# EAGLE design BMV1 (EAGLE 4.16)
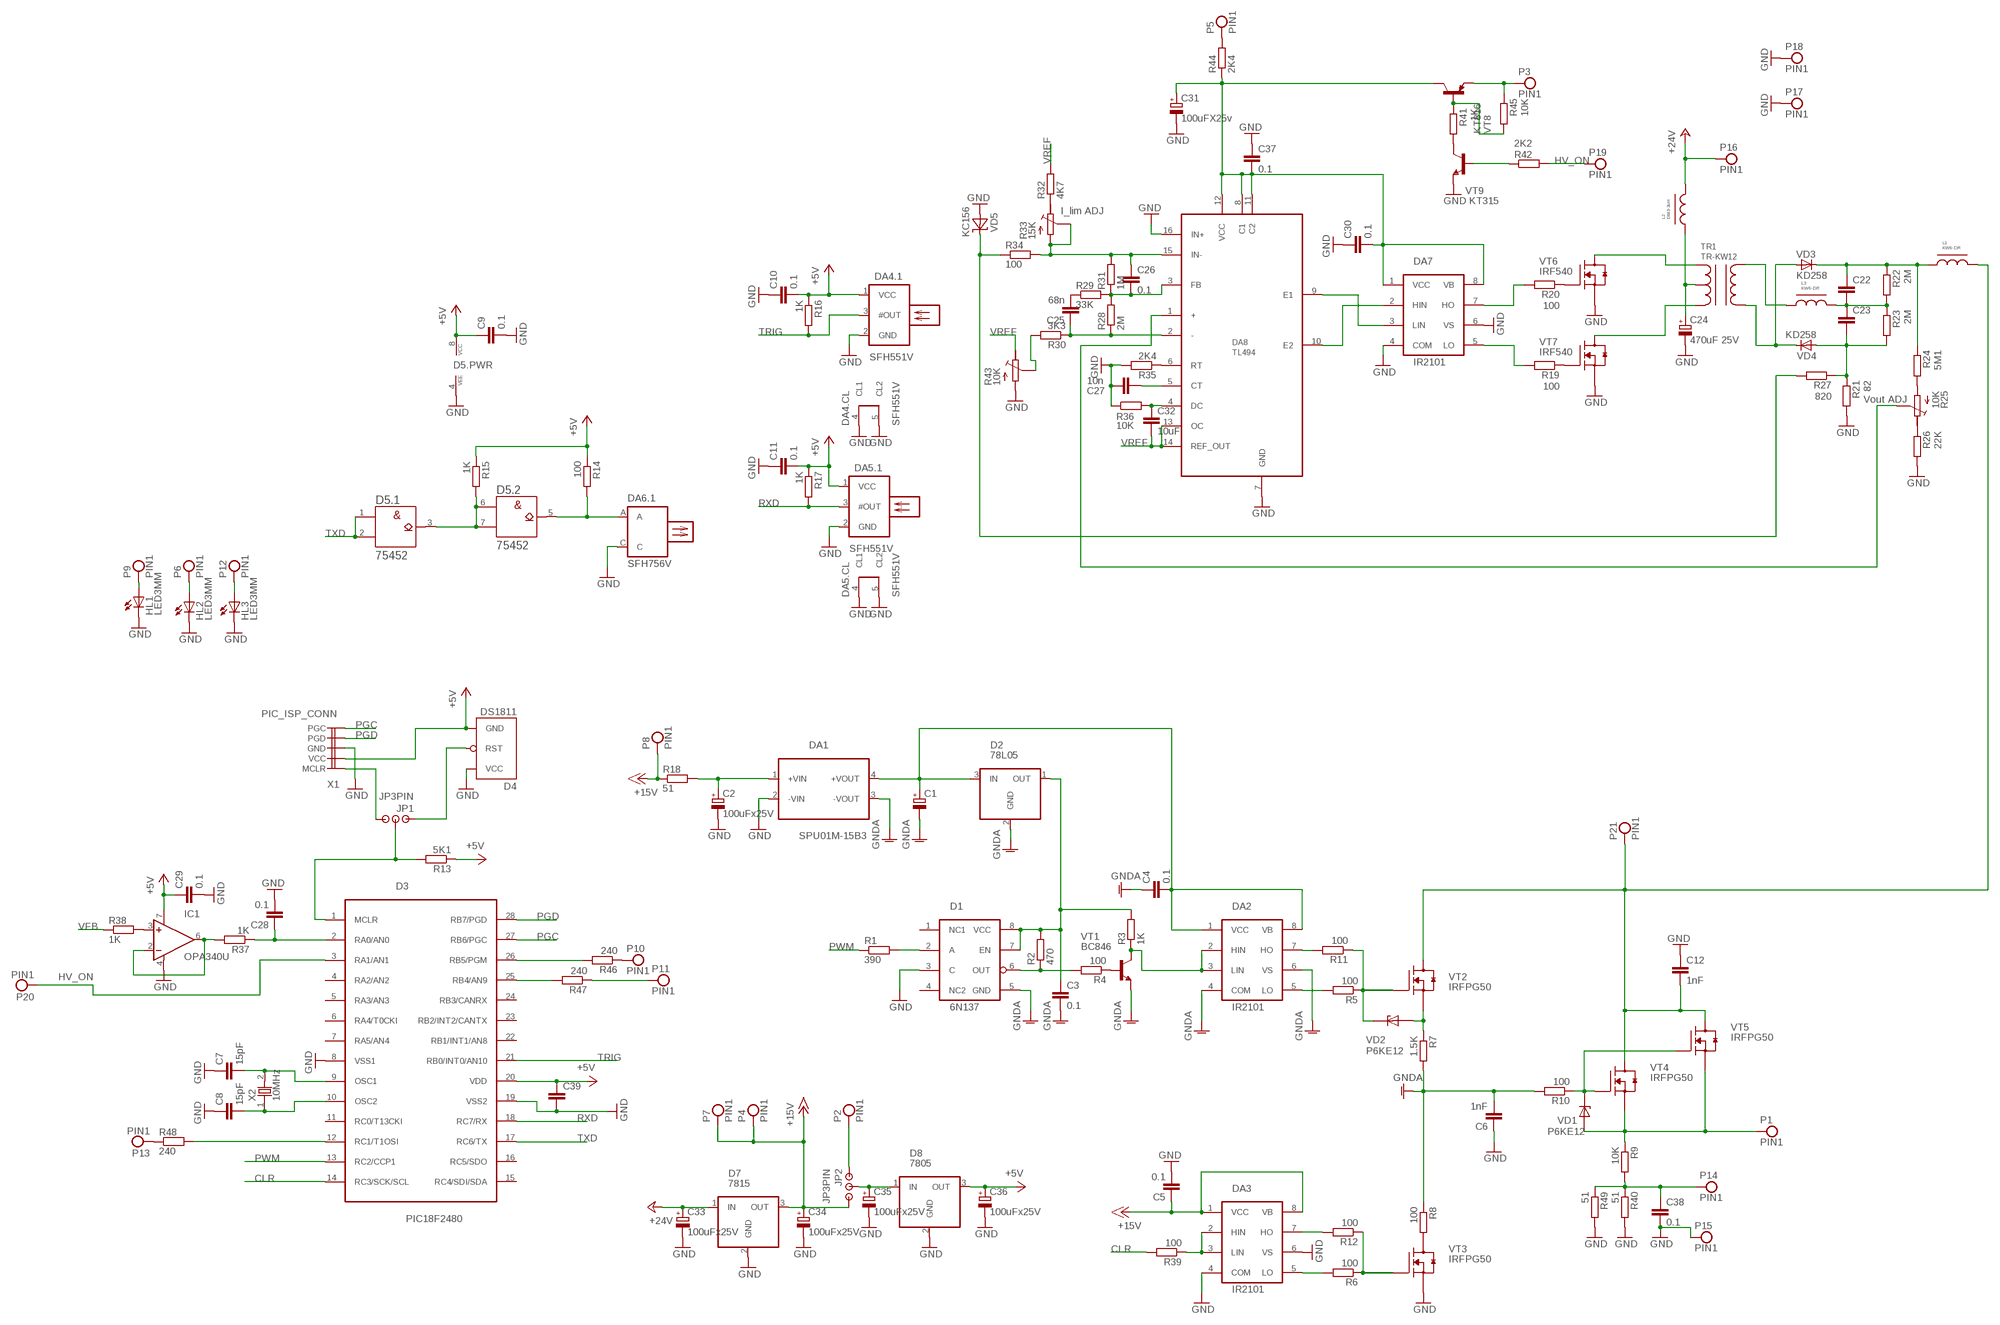
[diagram p0: schematic, sheet 1]

## Parts
C1  C100MFX25V  [C100MILX6X12]
C2  100uFx25V  C100MFX25V  [C100MILX6X12]
C3  0.1  C0805  [C0805D]
C4  0.1  C0805KM-6  [C050-025X075]
C5  0.1  C0805  [C0805D]
C6  1nF  C1NF1600V  [K15-5-1]
C7  15pF  C0805  [C0805D]
C8  15pF  C0805  [C0805D]
C9  0.1  C0805  [C0805D]
C10  0.1  C0805  [C0805D]
C11  0.1  C0805  [C0805D]
C12  1nF  C1NF1600V  [K15-5-1]
C22  0.47UF630V  [K73-17-2]
C23  0.47UF630V  [K73-17-2]
C24  470uF 25V  C470X25V  [ELC8X3,5]
C25  68n  KM-6SMD  [C0805D]
C26  0.1  KM-6SMD  [C0805D]
C27  10n  KM-6SMD  [C0805D]
C28  0.1  C0805  [C0805D]
C29  0.1  C0805  [C0805D]
C30  0.1  KM-6SMD  [C0805D]
C31  100uFX25v  C100MFX25V  [C100MILX6X12]
C32  10uF  KM-6SMD  [C0805D]
C33  100uFx25V  C100MFX25V  [C100MILX6X12]
C34  100uFx25V  C100MFX25V  [C100MILX6X12]
C35  100uFx25V  C100MFX25V  [C100MILX6X12]
C36  100uFx25V  C100MFX25V  [C100MILX6X12]
C37  0.1  KM-6SMD  [C0805D]
C38  0.1  C0805  [C0805D]
C39  KM-6SMD1  [C0603]
D1  6N137  [DIL08]
D2  78L05  [TO92-60]
D3  PIC18F2480  [SO-28W]
D4  DS1811  [TO92-60]
D5  75452  [DIL08]
D7  7815  [TO220V]
D8  7805  [TO220V]
DA1  SPU01M-15B3  [SIL7-V2]
DA2  IR2101  [DIL08]
DA3  IR2101  [DIL08]
DA4  SFH551V  [SFH551V]
DA5  SFH551V  [SFH551V]
DA6  SFH756V  [SFH756V]
DA7  IR2101  [DIL08]
DA8  TL494  [DIL16]
HL1  LED3MM  [LED3MM]
HL2  LED3MM  [LED3MM]
HL3  LED3MM  [LED3MM]
IC1  OPA340U  [SO08]
JP1  JP3PIN  [PLC-3PIN]
JP2  JP3PIN  [PLC-3PIN]
L1  KW6-DR  [KW6-DR]
L2  DM3-3uH  DM3  [DM3]
L3  KW6-DR  [KW6-DR]
P1  PIN1  [PIN1]
P2  PIN1  [PIN1]
P3  PIN1  [PIN1]
P4  PIN1  [PIN1]
P5  PIN1  [PIN1]
P6  PIN1  [PIN1]
P7  PIN1  [PIN1]
P8  PIN1  [PIN1]
P9  PIN1  [PIN1]
P10  PIN1  [PIN1]
P11  PIN1  [PIN1]
P12  PIN1  [PIN1]
P13  PIN1  [PIN1]
P14  PIN1  [PIN1]
P15  PIN1  [PIN1]
P16  PIN1  [PIN1]
P17  PIN1  [PIN1]
P18  PIN1  [PIN1]
P19  PIN1  [PIN1]
P20  PIN1  [PIN1]
P21  PIN1  [PIN1]
R1  390  MLT025"  [0207/10]
R2  470  MLT025SMD  [R0805D]
R3  1K  MLT025"  [0207/10]
R4  100  MLT025"  [0207/10]
R5  100  MLT025SMD  [R0805D]
R6  100  MLT025SMD  [R0805D]
R7  1.5K  MLT025"  [0207/10]
R8  100  MLT025  [MLT1]
R9  10K  MLT025TWO-2  [TWO-2]
R10  100  MLT025"  [0207/10]
R11  100  MLT025SMD  [R0805D]
R12  100  MLT025SMD  [R0805D]
R13  5K1  MLT025SMD  [R0805D]
R14  100  MLT025SMD  [R0805D]
R15  1K  MLT025SMD  [R0805D]
R16  1K  MLT025SMD  [R0805D]
R17  1K  MLT025SMD  [R0805D]
R18  51  MLT025SMD  [R0805D]
R19  100  MLT025SMD  [R0805D]
R20  100  MLT025"  [0207/10]
R21  82  MLT025"  [0207/10]
R22  2M  MLT025"  [0207/10]
R23  2M  MLT025"  [0207/10]
R24  5M1  MLT025MLT2  [MLT2]
R25  10K  RTRIM3296W  [RTRIM3296W]
R26  22K  MLT025SMD  [R0805D]
R27  820  MLT025"  [0207/10]
R28  2M  MLT025SMD  [R0805D]
R29  33K  MLT025SMD  [R0805D]
R30  3K3  MLT025SMD  [R0805D]
R31  1M  MLT025SMD  [R0805D]
R32  4K7  MLT025SMD  [R0805D]
R33  15K  RTRIM3329H  [RTRIM3329H]
R34  100  MLT025"  [0207/10]
R35  2K4  MLT025SMD  [R0805D]
R36  10K  MLT025SMD  [R0805D]
R37  1K  MLT025"  [0207/10]
R38  1K  MLT025"  [0207/10]
R39  100  MLT025"  [0207/10]
R40  51  MLT025"  [0207/10]
R41  1K  MLT025SMD  [R0805D]
R42  2K2  MLT025"  [0207/10]
R43  10K  RTRIM3296W  [RTRIM3296W]
R44  2K4  MLT025"  [0207/10]
R45  10K  MLT025SMD  [R0805D]
R46  240  MLT025SMD  [R0805D]
R47  240  MLT025SMD  [R0805D]
R48  240  MLT025"  [0207/10]
R49  51  MLT025SMD  [R0805D]
TR1  TR-KW12  [KW12]
VD1  P6KE12  [DO-15]
VD2  P6KE12  [DO-15]
VD3  KD258  [KD-29A]
VD4  KD258  [KD-29A]
VD5  KC156  [KC156]
VT1  BC846  [SOT-23]
VT2  IRFPG50  [TO-247AC]
VT3  IRFPG50  [TO-247AC]
VT4  IRFPG50  [TO-247AC]
VT5  IRFPG50  [TO-247AC]
VT6  IRF540  [TO220V]
VT7  IRF540  [TO220V]
VT8  KT816  [TO126V]
VT9  KT315  [KT315]
X1  PIC_ISP_CONN  [PLC-5PIN]
X2  10MHz  HC49/U  [HC49U-V]

## Nets
+5V: C9.1 C10.2 C11.2 C29.1 C36.PLUS(+) C39.1 D3.20(VDD) D4.3(GND) D5.8(.PWR:VCC) D8.3(OUT) DA4.1(.1:VCC) DA5.1(.1:VCC) IC1.7(V+) R13.P$1 R14.P$1 R15.P$1 R16.P$1 R17.P$1 X1.P$2(VCC)
+15V: C5.1 C34.PLUS(+) D7.3(OUT) DA3.1(VCC) DA3.8(VB) JP2.P$3 P4.P$1 P7.P$1 P8.P$1 R18.P$1
+24V: C33.PLUS(+) D7.1(IN) L2.L2 P16.P$1
CLR: D3.14(RC3/SCK/SCL) R39.2
GND: C2.MINUS(-) C5.2 C6.P$1 C7.1 C8.1 C9.2 C10.1 C11.1 C12.P$1 C24.- C27.2 C28.2 C29.2 C30.1 C31.MINUS(-) C33.MINUS(-) C34.MINUS(-) C35.MINUS(-) C36.MINUS(-) C37.1 C38.2 C39.2 D1.3(C) D3.8(VSS1) D3.19(VSS2) D4.2(VCC) D5.4(.PWR:VEE) D7.2(GND) D8.2(GND) DA1.2(-VIN) DA3.4(COM) DA3.6(VS) DA4.2(.1:GND) DA4.4(.CL:CL1) DA4.5(.CL:CL2) DA5.2(.1:GND) DA5.4(.CL:CL1) DA5.5(.CL:CL2) DA6.C(.1:C) DA7.4(COM) DA7.6(VS) DA8.7(GND) DA8.16(IN+) HL1.K(C) HL2.K(C) HL3.K(C) IC1.4(V-) P15.P$1 P17.P$1 P18.P$1 R21.2 R26.P$2 R35.P$2 R36.P$1 R40.2 R43.3(E) R49.P$2 VD5.A VT3.3(S) VT6.3(S) VT7.3(S) VT9.E X1.P$3(GND)
GNDA: C1.MINUS(-) C3.2 C4.1 C6.P$2 D1.5(GND) D2.2(GND) DA1.3(-VOUT) DA2.4(COM) DA2.6(VS) R7.2 R8.P$1 R10.2 VT1.2(E)
HV_ON: D3.3(RA1/AN1) P19.P$1 P20.P$1 R42.2
N$1: C1.PLUS(+) C4.2 D2.3(IN) DA1.4(+VOUT) DA2.1(VCC) DA2.8(VB)
N$2: C3.1 D1.7(EN) D1.8(VCC) D2.1(OUT) R2.P$2 R3.2
N$3: D1.6(OUT) R2.P$1 R4.2
N$4: D1.2(A) R1.2
N$5: DA2.2(HIN) DA2.3(LIN) R3.1 VT1.3(C)
N$6: R4.1 VT1.1(B)
N$7: DA2.5(LO) R5.P$2
N$8: DA3.5(LO) R6.P$2
N$9: R5.P$1 R11.P$1 VD2.C VT2.1(G)
N$10: R6.P$1 R12.P$1 VT3.1(G)
N$11: R7.1 VD2.A VT2.3(S)
N$12: R8.P$2 VT3.2(D)
N$13: D5.3(.1:Y) D5.6(.2:A) D5.7(.2:B) R15.P$2
N$14: C24.+ L2.L1 TR1.12
N$15: R10.1 VD1.C VT4.1(G) VT5.1(G)
N$16: C12.P$2 L1.L2 P21.P$1 VT2.2(D) VT4.2(D) VT5.2(D)
N$17: DA3.7(HO) R12.P$2
N$18: DA2.7(HO) R11.P$2
N$19: C7.2 D3.9(OSC1) X2.2
N$20: C8.2 D3.10(OSC2) X2.1
N$21: D4.1(RST) JP1.P$1
N$22: JP1.P$3 X1.P$1(MCLR)
N$23: D3.1(MCLR) JP1.P$2 R13.P$2
N$24: D5.5(.2:Y) DA6.A(.1:A) R14.P$2
N$25: C2.PLUS(+) DA1.1(+VIN) R18.P$2
N$26: P1.P$1 R9.P$1 VD1.A VT4.3(S) VT5.3(S)
N$27: R19.P$1 VT7.1(G)
N$28: R20.1 VT6.1(G)
N$29: DA7.5(LO) R19.P$2
N$30: DA7.7(HO) R20.2
N$31: DA3.2(HIN) DA3.3(LIN) R39.1
N$32: TR1.11 VT6.2(D)
N$33: TR1.13 VT7.2(D)
N$34: DA7.3(LIN) DA8.9(E1)
N$35: DA7.2(HIN) DA8.10(E2)
N$36: R27.2 R34.1 VD5.C
N$37: R32.P$1 R33.P$1(A)
N$38: C22.P$2 C23.P$1 L3.L2 R22.2 R23.1
N$39: C22.P$1 L1.L1 R22.1 R24.P$1 VD3.C
N$40: C25.1 DA8.2(-) R28.P$1 R30.P$1
N$41: R24.P$2 R25.3(E)
N$42: R25.1(A) R26.P$1
N$43: C30.2 C31.PLUS(+) C37.2 DA7.1(VCC) DA7.8(VB) DA8.8(C1) DA8.11(C2) DA8.12(VCC) R44.1 VT8.2(C)
N$44: C23.P$2 R21.1 R23.2 R27.1 VD4.A
N$45: C26.2 DA8.3(FB) R28.P$2 R29.P$2 R31.P$1
N$46: C25.2 R29.P$1
N$47: DA8.6(RT) R35.P$1
N$48: C26.1 DA8.15(IN-) R31.P$2 R33.P$2(S) R33.P$3(E) R34.2
N$49: L3.L1 TR1.21
N$50: C27.1 DA8.5(CT)
N$51: C32.1 DA8.4(DC) R36.P$2
N$52: IC1.2(-IN) IC1.6(OUT) R37.2
N$53: C28.1 D3.2(RA0/AN0) R37.1
N$54: IC1.3(+IN) R38.2
N$55: TR1.22 VD3.A VD4.C
N$56: R30.P$2 R43.2(S)
N$57: C38.1 P14.P$1 R9.P$2 R40.1 R49.P$1
N$58: R41.P$1 R45.P$2 VT8.3(B)
N$59: R41.P$2 VT9.C
N$60: JP2.P$1 P2.P$1
N$61: P3.P$1 R45.P$1 VT8.1(E)
N$62: C35.PLUS(+) D8.1(IN) JP2.P$2
N$63: R42.1 VT9.B
N$64: P5.P$1 R44.2
N$65: HL2.A P6.P$1
N$66: HL1.A P9.P$1
N$67: D3.26(RB5/PGM) R46.P$2
N$68: P10.P$1 R46.P$1
N$69: D3.25(RB4/AN9) R47.P$2
N$70: P11.P$1 R47.P$1
N$71: HL3.A P12.P$1
N$72: D3.12(RC1/T1OSI) R48.2
N$73: P13.P$1 R48.1
PGC: D3.27(RB6/PGC) X1.P$5(PGC)
PGD: D3.28(RB7/PGD) X1.P$4(PGD)
PWM: D3.13(RC2/CCP1) R1.1
RXD: D3.18(RC7/RX) DA5.3(.1:#OUT) R17.P$2
TRIG: D3.21(RB0/INT0/AN10) DA4.3(.1:#OUT) R16.P$2
TXD: D3.17(RC6/TX) D5.1(.1:A) D5.2(.1:B)
VFB: DA8.1(+) R25.2(S) R38.1
VREF: C32.2 DA8.13(OC) DA8.14(REF_OUT) R32.P$2 R43.1(A)
Unconnected: D1.1(NC1) D1.4(NC2) D3.4(RA2/AN2) D3.5(RA3/AN3) D3.6(RA4/T0CKI) D3.7(RA5/AN4) D3.11(RC0/T13CKI) D3.15(RC4/SDI/SDA) D3.16(RC5/SDO) D3.22(RB1/INT1/AN8) D3.23(RB2/INT2/CANTX) D3.24(RB3/CANRX) DA6.4(.CL:CL1) DA6.5(.CL:CL2)

## Notes on the sheet
- I_lim ADJ
- Vout ADJ

## Library data of the parts
C1 C2 C31 C33-C36 = den:C100MFX25V
C3-C5 C7-C11 C28 C29 C38 = den:C0805
C6 C12 = den:C1NF1600V
C22 C23 = den:0.47UF630V
C24 = den:C470X25V
C25-C27 C30 C32 C37 C39 = den:KM-6
D1 = den:6N137
D2 = den:78L05
D3 = den:PIC18F2480
D4 = den:DS1811
D5 = den:75452
D7 = den:7815
D8 = den:7805
DA1 = den:SPU01M-15B3
DA2 DA3 DA7 = den:IR2101
DA4 DA5 = den:SFH551V
DA6 = den:SFH756V
DA8 = den:TL494
HL1-HL3 = den:LED3MM
IC1 = burr-brown:OPA340: Rail-to-Rail Operational Amplifiers Single-Supply, MicroAmplifier(TM) Series
JP1 JP2 = den:JP3PIN
L1 L3 = den:KW6-DR
L2 = den:DM3
P1-P21 = den:PIN1
R1-R24 R26-R32 R34-R42 R44-R49 = den:MLT025
R25 R43 = den:RTRIM3296W
R33 = den:RTRIM3329H
TR1 = den:TR-KW12
VD1 VD2 = den:P6KE12
VD3 VD4 = den:KD258
VD5 = den:KC156
VT1 = den:BC846
VT2-VT5 = den:IRFPG50
VT6 VT7 = den:IRF540
VT8 = den:KT816
VT9 = den:KT315
X1 = den:PIC_ISP_CONN
X2 = den:HC49/U

## Board
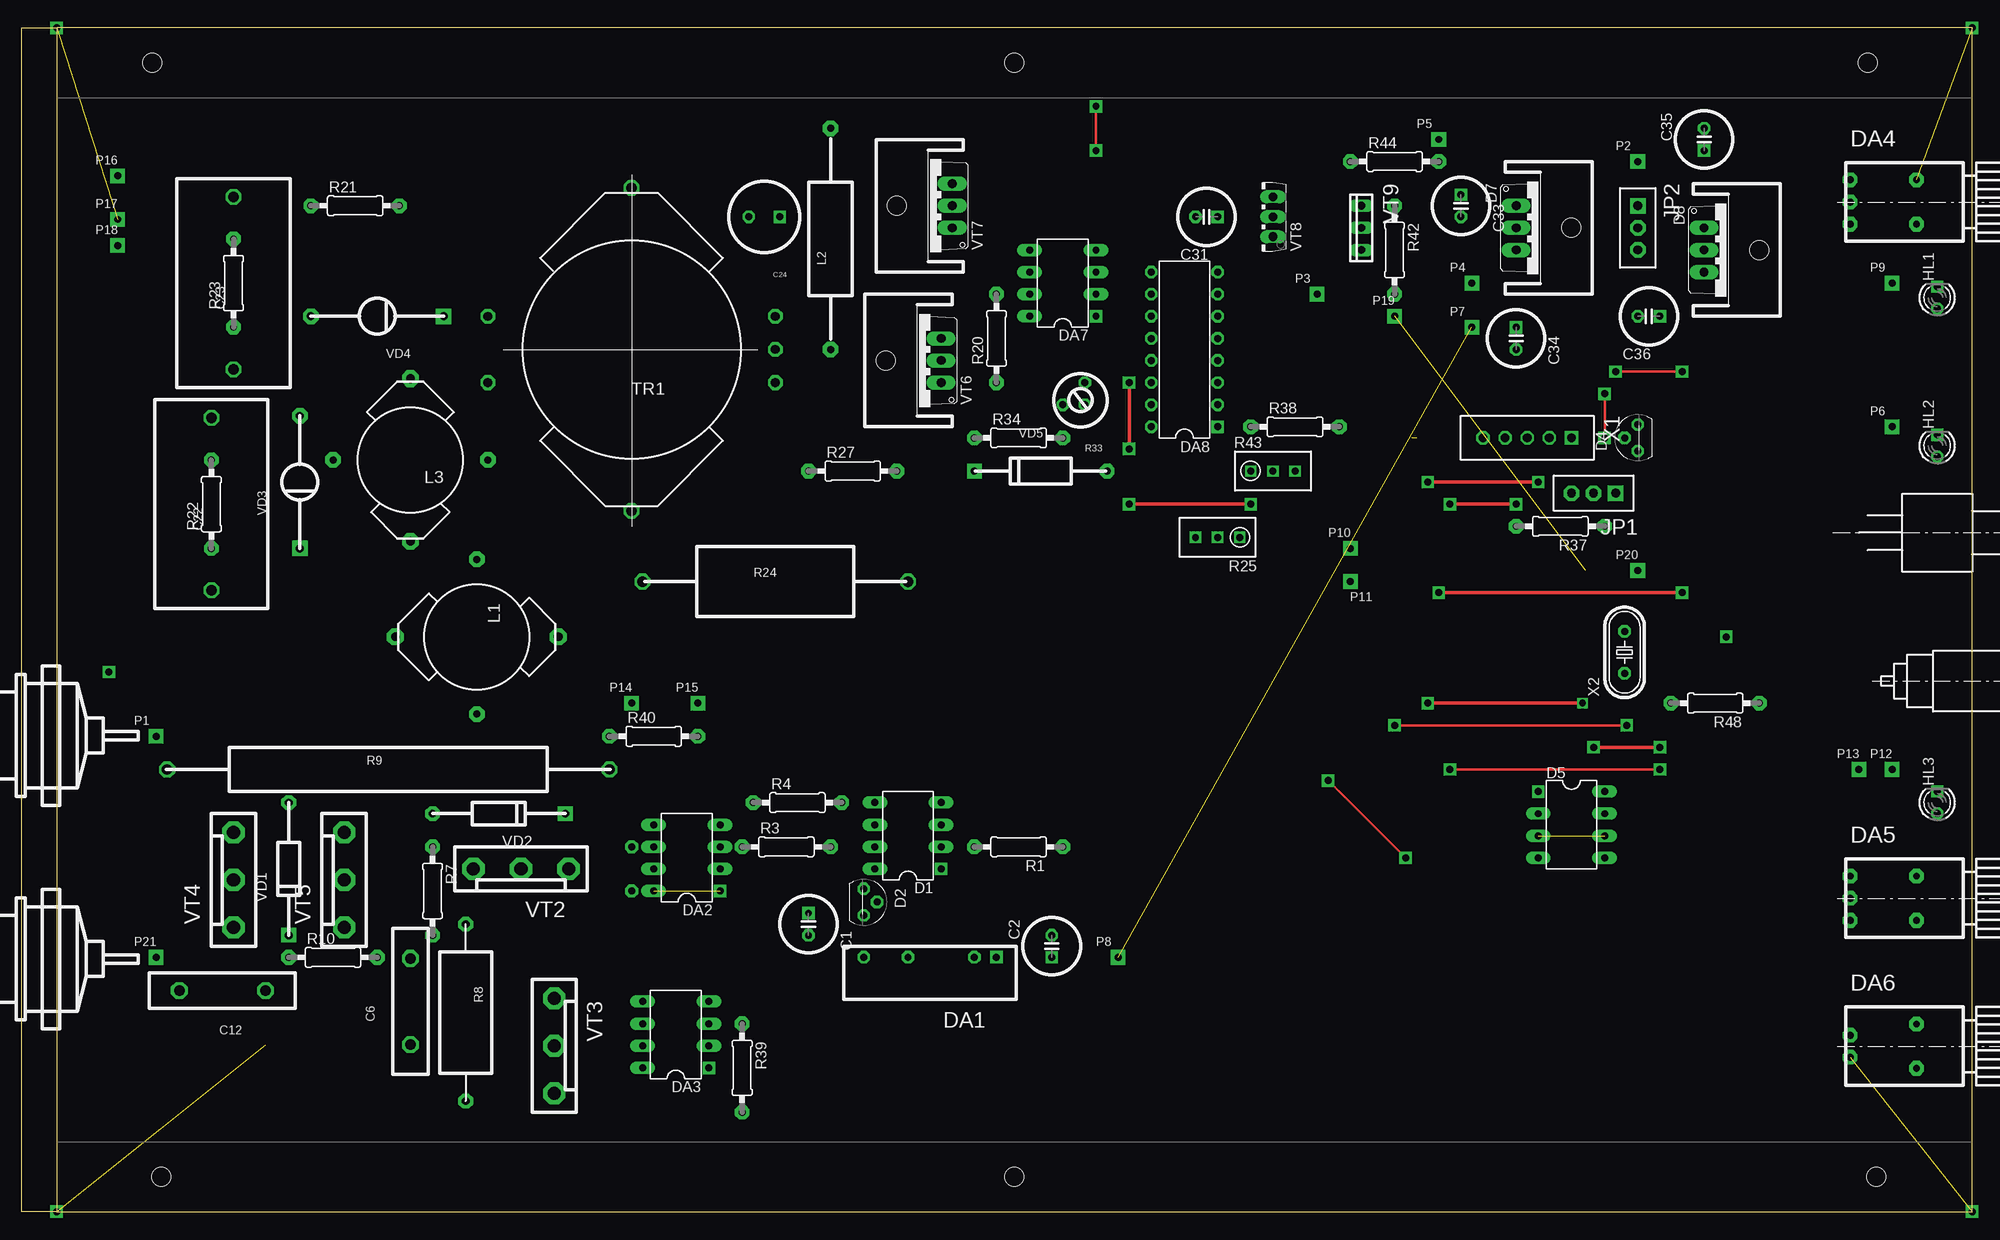
[diagram p1: board, top side]
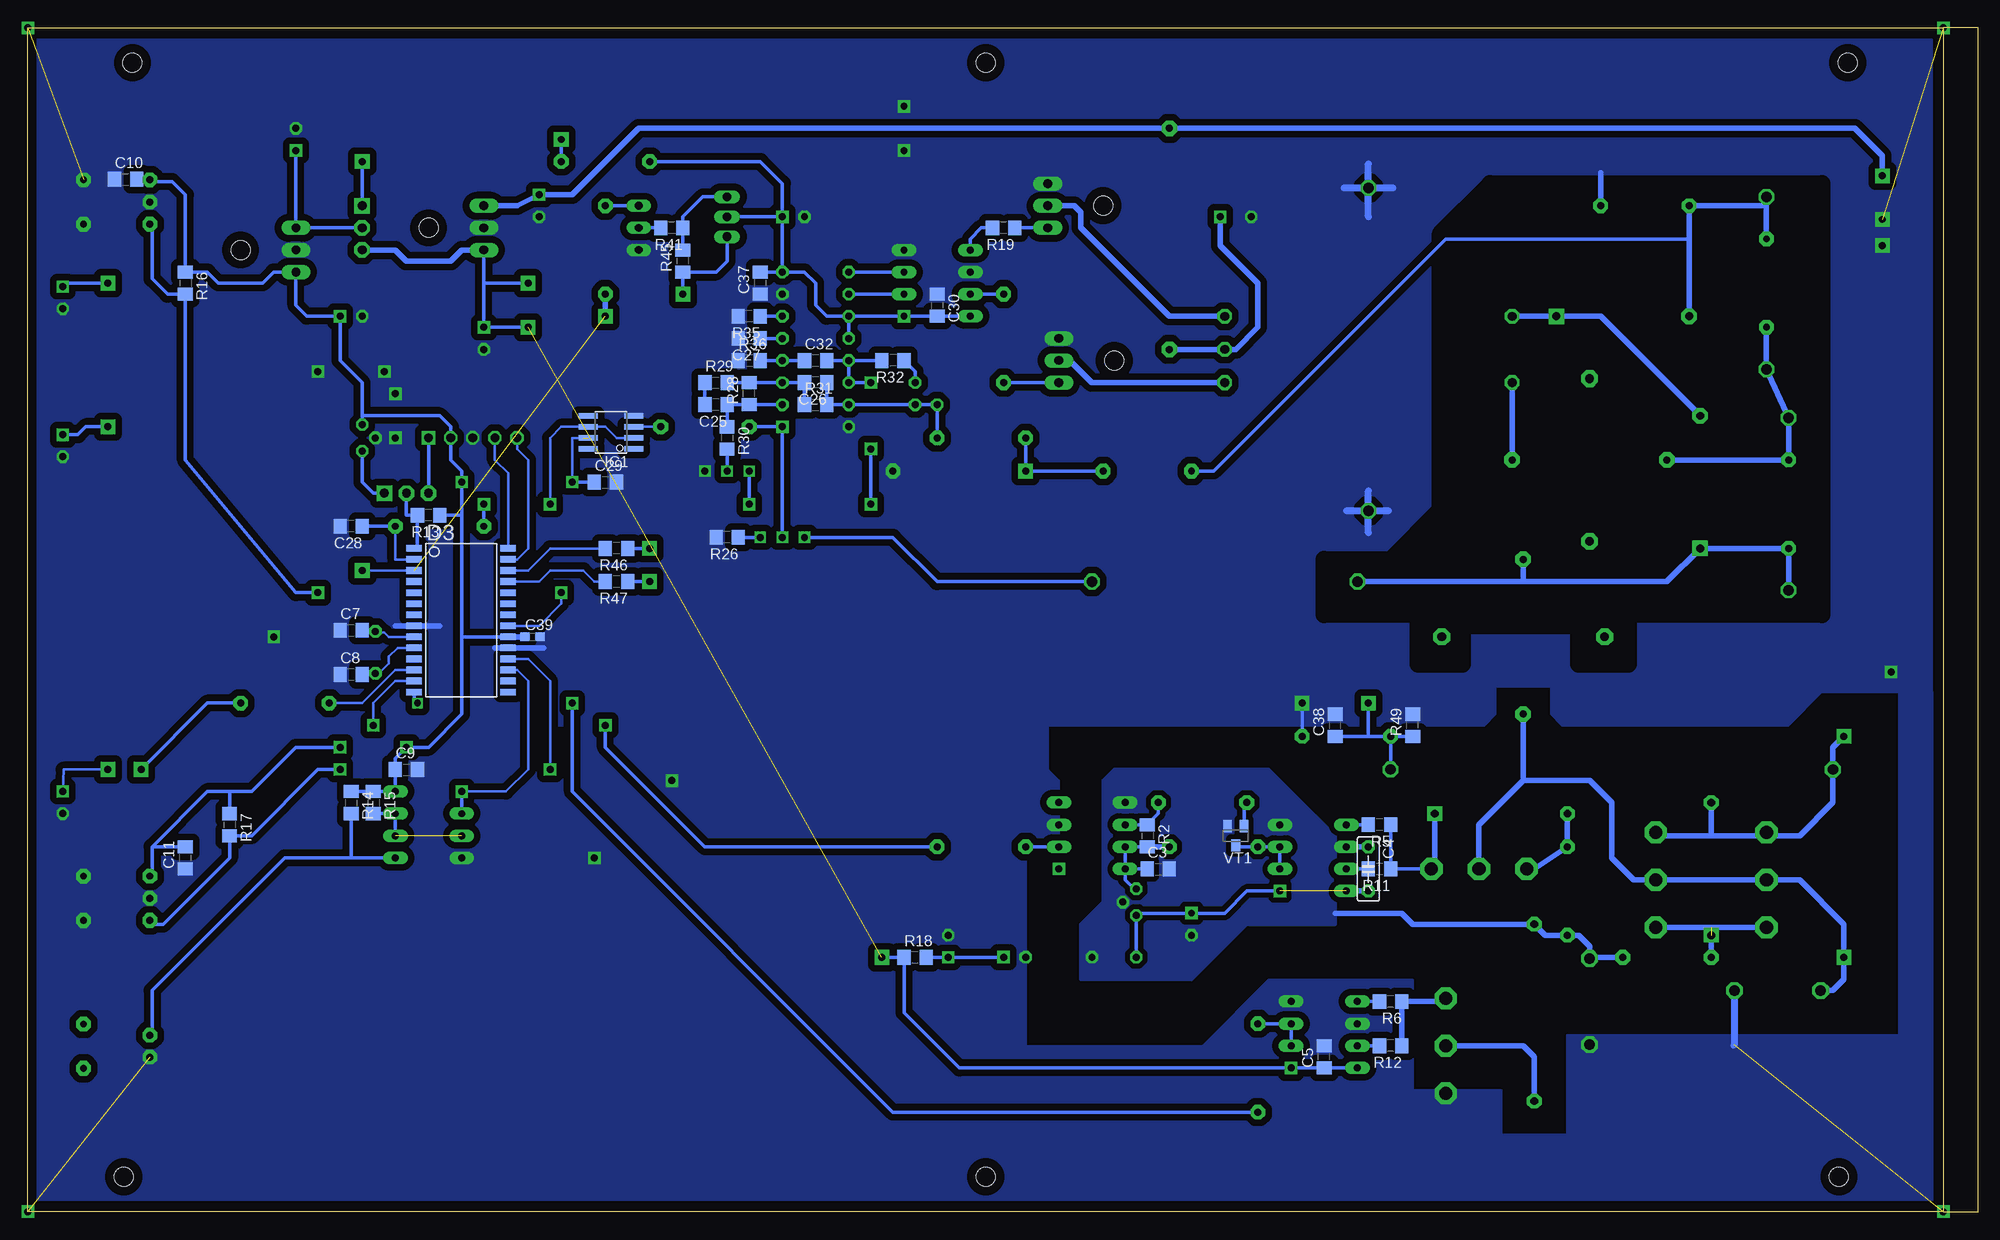
[diagram p2: board, bottom side, seen from below]

Size 224 x 136 mm. Coordinates in mm from the lower left corner, seen from the top.
Outline: 4,0 224,0 224,136 4,136
Outline: 4,136 4,0
Outline: 4,0 0,0 0,136 4,136
Copper layers (1*16): Top 0.035mm / dielectric 1.5mm / Bottom 0.035mm
Design rules "default": minimum track width 10mil, minimum drill 24mil, track to track 8mil, track to pad 8mil, pad to pad 8mil, via to via 8mil, smd to smd 8mil, copper to edge 40mil, drill to drill 8mil, minimum pad ring 10mil, minimum via ring 8mil, stop-mask expansion 4mil, vias tented up to drill 0mil, thermal gap 10mil
Holes 2.2 mm at 16,4 114,4 213,4 212,132 114,132 15,132
bRestrict: area 18,62.9 to 75.1,118.1

### Footprints (pad centres in the part's own frame; a part is rotated, then mirrored left to right if it is on the bottom)
C100MILX6X12 = drill 0.8 pad 1.422 octagon: MINUS 1.27,0 | drill 0.8 pad 1.422 square: PLUS -1.27,0
C0805D = smd 1.5 x 1.7: 1 -1.27,0; 2 1.27,0
C050-025X075 = drill 0.8 pad 1.5 octagon: 1 -2.54,0; 2 2.54,0
K15-5-1 = drill 1.2 pad 1.93 octagon: P$1 -4.953,0; P$2 4.953,0
K73-17-2 = drill 1.2 pad 1.778 octagon: P$1 -9.906,0; P$2 9.906,0
ELC8X3,5 = drill 0.8 pad 1.422 square: + -1.778,0 | drill 0.8 pad 1.422 octagon: - 1.778,0
C0603 = smd 1.1 x 1: 1 -0.85,0; 2 0.85,0
DIL08 = drill 0.8 pad 1.422 square: 1 -3.81,-3.81 | drill 0.8 pad 1.422 long: 2 -1.27,-3.81; 3 1.27,-3.81; 4 3.81,-3.81; 5 3.81,3.81; 6 1.27,3.81; 7 -1.27,3.81; 8 -3.81,3.81
TO92-60 = drill 0.8 pad 1.422 octagon: 1 -1.524,0; 2 0,1.524; 3 1.524,0
SO-28W = smd 0.762 x 1.778: 1 -7.62,-5.461; 2 -6.35,-5.461; 3 -5.08,-5.461; 4 -3.81,-5.461; 5 -2.54,-5.461; 6 -1.27,-5.461; 7 0,-5.461; 8 1.27,-5.461; 9 2.54,-5.461; 10 3.81,-5.461; 11 5.08,-5.461; 12 6.35,-5.461; 13 7.62,-5.461; 14 8.89,-5.461; 15 8.89,5.334; 16 7.62,5.334; 17 6.35,5.334; 18 5.08,5.334; 19 3.81,5.334; 20 2.54,5.334; 21 1.27,5.334; 22 0,5.334; 23 -1.27,5.334; 24 -2.54,5.334; 25 -3.81,5.334; 26 -5.08,5.334; 27 -6.35,5.334; 28 -7.62,5.334
TO220V = drill 1 pad 1.676 long: 1 -2.54,0; 2 0,0; 3 2.54,0
SIL7-V2 = drill 0.8 pad 1.422 square: 1 0,-0.02 | drill 0.8 pad 1.422 octagon: 2 2.54,-0.02; 3 10.16,-0.02; 4 15.24,-0.02
SFH551V = drill 0.8 pad 1.676 octagon: 1 0,2.54; 2 0,0; 3 0,-2.54; 4 7.62,2.54; 5 7.62,-2.54
SFH756V = drill 0.8 pad 1.676 octagon: 4 7.62,2.54; 5 7.62,-2.54; A 0,1.27; C 0,-1.27
DIL16 = drill 0.8 pad 1.422 square: 1 -8.89,-3.81 | drill 0.8 pad 1.422 octagon: 2 -6.35,-3.81; 3 -3.81,-3.81; 4 -1.27,-3.81; 5 1.27,-3.81; 6 3.81,-3.81; 7 6.35,-3.81; 8 8.89,-3.81; 9 8.89,3.81; 10 6.35,3.81; 11 3.81,3.81; 12 1.27,3.81; 13 -1.27,3.81; 14 -3.81,3.81; 15 -6.35,3.81; 16 -8.89,3.81
LED3MM = drill 0.8 pad 1.422 square: A 1.27,0 | drill 0.8 pad 1.422 octagon: K -1.27,0
SO08 = smd 0.61 x 2.21: 1 0,0.559; 2 1.27,0.559; 3 2.54,0.559; 4 3.81,0.559; 5 3.81,5.791; 6 2.54,5.791; 7 1.27,5.791; 8 0,5.791
PLC-3PIN = drill 1 pad 1.778 square: P$1 0,0 | drill 1 pad 1.778 octagon: P$2 2.54,0; P$3 5.08,0
KW6-DR = drill 0.8 pad 1.778 octagon: L1 -8.89,0; L2 8.89,0 | drill 1 pad 1.93 octagon: P$3 0,-9.35; P$4 0,9.35
DM3 = drill 0.8 pad 1.778 octagon: L1 -12.7,0; L2 12.7,0
PIN1 = drill 0.8 pad 1.676 square: P$1 0,0
0207/10 = drill 0.8 pad 1.676 octagon: 1 -5.08,0; 2 5.08,0
R0805D = smd 1.5 x 1.7: P$1 -1.27,0; P$2 1.27,0
MLT1 = drill 0.9 pad 1.676 octagon: P$1 -10.16,0; P$2 10.16,0
TWO-2 = drill 1.2 pad 1.778 octagon: P$1 -25.4,0; P$2 25.4,0
MLT2 = drill 1.2 pad 1.778 octagon: P$1 -15.24,0; P$2 15.24,0
RTRIM3296W = drill 0.8 square: 1 0,-2.54; 2 0,0; 3 0,2.54
RTRIM3329H = drill 0.8 pad 1.422 octagon: P$1 0,-2.54; P$2 0,0; P$3 2.54,0
KW12 = drill 1 pad 1.676 octagon: 11 -16.51,3.81; 12 -16.51,0; 13 -16.51,-3.81; 21 16.51,3.81; 22 16.51,-3.81 | drill 1.2 pad 1.778 octagon: GND1 0,-18.542; GND2 0,18.542
REFL_KG288-15 = hole 2.2: 0,0
DO-15 = drill 0.9 pad 1.676 octagon: A 7.62,0 | drill 0.9 pad 1.676 square: C -7.62,0
KD-29A = drill 0.9 pad 1.778 octagon: A 7.62,0 | drill 0.9 pad 1.778 square: C -7.62,0
KC156 = drill 0.8 pad 1.676 octagon: A 7.62,0 | drill 0.8 pad 1.676 square: C -7.62,0
SOT-23 = smd 1 x 1.4: 1 -0.95,-1.1; 2 0.95,-1.1; 3 0,1.1
TO-247AC = drill 1.5 pad 2.54 octagon: 1 -5.461,0; 2 0,0; 3 5.461,0
TO126V = drill 1 long: 1 -2.286,0; 2 0,0; 3 2.286,0
KT315 = drill 0.9 long: B -2.54,0; C 0,0; E 2.54,0
PLC-5PIN = drill 1 square: P$1 0,5.08 | drill 1 octagon: P$2 0,2.54; P$3 0,0; P$4 0,-2.54; P$5 0,-5.08
HC49U-V = drill 0.8 pad 1.422 octagon: 1 -2.413,0; 2 2.413,0

### Placement (x,y rotation side)
C1  90.36,33.02 270 top
C2  118.3,30.48 90 top
C3  94.17,39.37 0 bottom
C4  70.04,39.37 270 bottom
C5  75.12,17.78 90 bottom
C6  44.64,24.13 90 top
C7  186.88,66.8 0 bottom
C8  186.88,61.72 0 bottom
C9  180.53,50.8 0 bottom
C10  212.79,118.62 0 bottom
C11  205.93,40.64 90 bottom
C12  23.05,25.4 180 top
C22  21.78,81.28 90 top
C23  24.32,106.68 90 top
C24  85.28,114.3 180 top
C25  144.97,92.71 180 bottom
C26  133.54,95.25 180 bottom
C27  141.16,100.33 180 bottom
C28  186.88,78.74 180 bottom
C29  157.67,83.82 0 bottom
C30  119.57,104.14 270 bottom
C31  136.08,114.3 180 top
C32  133.54,97.79 0 bottom
C33  165.29,115.57 270 top
C34  171.64,100.33 270 top
C35  193.23,123.19 90 top
C36  186.88,102.87 180 top
C37  139.89,106.68 90 bottom
C38  73.85,55.88 90 bottom
C39  166.05,66.04 0 bottom
D1  101.79,43.18 90 top
D2  96.71,35.56 270 top
D3  174.18,68.58 270 bottom
D4  185.61,88.9 90 top
D5  177.99,44.45 270 top
D7  171.64,113.03 270 top
D8  193.23,110.49 270 top
DA1  111.95,29.21 180 top
DA2  76.39,40.64 90 top
DA3  75.12,20.32 90 top
DA4  210,116 0 top
DA5  210,36 0 top
DA6  210,19 0 top
DA7  119.57,106.68 90 top
DA8  133.54,99.06 90 top
HL1  220,105 90 top
HL2  220,88 90 top
HL3  220,47 90 top
IC1  153.86,87.63 90 bottom
JP1  183.07,82.55 180 top
JP2  185.61,115.57 270 top
L1  52.26,66.04 270 top
L2  92.9,111.76 90 top
L3  44.64,86.36 180 top
P1  15.43,54.61 0 top
P2  185.61,120.65 0 top
P3  148.78,105.41 0 top
P4  166.56,106.68 0 top
P5  162.75,123.19 0 top
P6  214.82,90.17 0 top
P7  166.56,101.6 0 top
P8  125.92,29.21 0 top
P9  214.82,106.68 0 top
P10  152.59,76.2 0 top
P11  152.59,72.39 180 top
P12  214.82,50.8 0 top
P13  211.01,50.8 0 top
P14  70.04,58.42 0 top
P15  77.66,58.42 0 top
P16  11,119 0 top
P17  11,114 0 top
P18  11,111 0 top
P19  157.67,102.87 0 top
P20  185.61,73.66 0 top
P21  15.43,29.21 0 top
R1  114.49,41.91 180 top
R2  95.44,43.18 270 bottom
R3  87.82,41.91 0 top
R4  89.09,46.99 0 top
R5  68.77,44.45 180 bottom
R6  67.5,24.13 180 bottom
R7  47.18,36.83 270 top
R8  50.99,22.86 270 top
R9  42.1,50.8 0 top
R10  35.75,29.21 0 top
R11  68.77,39.37 180 bottom
R12  67.5,19.05 180 bottom
R13  177.99,80.01 180 bottom
R14  186.88,46.99 270 bottom
R15  184.34,46.99 270 bottom
R16  205.93,106.68 270 bottom
R17  200.85,44.45 270 bottom
R18  122.11,29.21 0 bottom
R19  111.95,113.03 180 bottom
R20  111.95,100.33 90 top
R21  38.29,115.57 0 top
R22  21.78,81.28 90 top
R23  24.32,106.68 90 top
R24  86.55,72.39 0 top
R25  137.35,77.47 90 top
R26  143.7,77.47 180 bottom
R27  95.44,85.09 0 top
R28  141.16,93.98 90 bottom
R29  144.97,95.25 0 bottom
R30  143.7,88.9 270 bottom
R31  133.54,92.71 0 bottom
R32  124.65,97.79 180 bottom
R33  122.11,92.71 180 top
R34  114.49,88.9 0 top
R35  141.16,102.87 180 bottom
R36  141.16,97.79 0 bottom
R37  176.72,78.74 180 top
R38  146.24,90.17 0 top
R39  82.74,16.51 270 top
R40  72.58,54.61 0 top
R41  150.05,113.03 180 bottom
R42  157.67,110.49 270 top
R43  143.7,85.09 270 top
R44  157.67,120.65 0 top
R45  148.78,109.22 90 bottom
R46  156.4,76.2 180 bottom
R47  156.4,72.39 180 bottom
R48  194.5,58.42 180 top
R49  64.96,55.88 90 bottom
TR1  70.04,99.06 180 top
U$1  [REFL_KG288-15]  100.52,115.57 90 top
U$2  [REFL_KG288-15]  99.25,97.79 90 top
U$3  [REFL_KG288-15]  177.99,113.03 270 top
U$4  [REFL_KG288-15]  199.58,110.49 270 top
U$5  [CP-50-73FW]  0.38,54.69 180 top
U$6  [CP-50-73FW]  0.38,29.02 180 top
U$7  [SS305]  224,78 0 top
U$8  [LEMO]  227.52,60.96 0 top  (outside the outline)
VD1  30.67,39.37 90 top
VD2  54.8,45.72 180 top
VD3  31.94,83.82 90 top
VD4  40.83,102.87 180 top
VD5  117.03,85.09 0 top
VT1  85.28,43.18 180 bottom
VT2  57.34,39.37 180 top
VT3  61.15,19.05 270 top
VT4  24.32,38.1 90 top
VT5  37.02,38.1 90 top
VT6  105.6,97.79 90 top
VT7  106.87,115.57 90 top
VT8  143.7,114.3 90 top
VT9  153.86,113.03 270 top
X1  172.91,88.9 270 top
X2  184.09,64.26 90 top

### Tracks (layer width: path | path; a pad name or v marks a point on that pad's centre or on a via)
+5V  (via drill 0.8 pad 1.42)  (1 unrouted)
  Top 0.406: v180.53,53.34 v188.15,53.34 | v174.18,83.82 v161.48,83.82
  Bottom 0.305: v161.48,83.82 161.48,88.9 160.21,88.9
  Bottom 0.406: 174.18,80.01 R13.P$1 | 174.18,66.04 D3.20 | 174.18,66.04 174.18,80.01 | 185.61,91.44 176.72,91.44 175.45,90.17 X1.P$2 175.45,86.36 174.18,85.09 v174.18,83.82 174.18,80.01 | 185.61,90.17 D4.3 185.61,91.44 | 185.61,91.44 185.61,95.25 188.15,97.79 C36.PLUS 191.96,102.87 193.23,104.14 D8.3 195.77,107.95 197.04,106.68 202.12,106.68 203.39,107.95 R16.P$1 205.93,116.84 207.45,118.36 209.74,118.36 DA4.1 209.74,118.62 C10.2 | 174.18,66.04 174.18,57.15 177.99,53.34 v180.53,53.34 181.8,52.07 C9.1 | D5.8 C9.1 | D5.8 R15.P$1 R14.P$1 | 209.74,41.91 209.74,38.1 210,38.36 DA5.1 | D5.8 C9.1 | 200.85,48.26 R17.P$1 | 200.85,48.26 198.31,48.26 193.23,53.34 v188.15,53.34 | v161.48,83.82 C29.1 | 200.85,48.26 203.39,48.26 209.74,41.91 | 209.74,41.91 C11.2
  Bottom 0.61: D3.20 C39.1
+15V  (1 unrouted)
  Bottom 0.406: DA3.8 DA3.1 C5.1 117.03,16.51 123.38,22.86 R18.P$1 P8.P$1 | P4.P$1 171.64,106.68 D7.3 C34.PLUS P7.P$1
  Bottom 0.61: D7.3 174.18,110.49 175.45,109.22 180.53,109.22 181.8,110.49 JP2.P$3
+24V
  Bottom 0.61: D7.1 167.83,115.57 C33.PLUS 161.48,116.84 153.86,124.46 L2.L2 14.16,124.46 11,121.3 P16.P$1
CLR  (via drill 0.8, 0.8 pad 1.42)
  Top 0.406: v161.48,58.42 v179.26,58.42
  Bottom 0.406: R39.2 124.65,11.43 161.48,48.26 v161.48,58.42 | D3.14 179.64,58.8 v179.26,58.42
GND  (via drill 0.8 pad 1.42)  (4 unrouted)
  Top 0.305: v158.94,40.64 v150.05,49.53 | v123.38,121.92 v123.38,127 | v183.07,96.52 v190.69,96.52 | v181.8,88.9 v181.8,93.98
  Bottom 0.406: R40.2 P15.P$1
  Bottom 0.61: 176.72,67.31 181.8,67.31 | R21.2 43.37,119.38 | 28,19.18 28.13,19.05 | 164.78,64.77 170.37,64.77
  Bottom 0.813: 67.25,117.6 72.83,117.6 | 70.04,114.3 70.04,120.4 | 70.04,77.98 70.04,82.8 | 67.75,80.52 72.58,80.52 | C12.P$1 28,19.18
  other vias: 195.77,66.04 10,62 4,0 4,136 224,136 224,0
  pour Bottom (isolate 0.762, no thermals): 5.27,134.62 223.71,134.62 223.71,55.88 56.7,55.88 55.44,57.15 55.44,60.33 49.09,60.33 49.09,57.15 47.81,55.88 21.78,55.88 17.97,59.69 5.27,59.69
  pour Bottom (isolate 0.762, no thermals): 5.27,59.69 5.27,1.27 223.71,1.27 223.71,55.88 106.87,55.88 106.87,50.8 105.6,49.53 105.6,40.64 109.41,40.64 109.41,19.05 89.09,19.05 81.47,26.67 64.96,26.67 64.96,13.97 54.8,13.97 54.8,8.89 47.18,8.89 47.18,20.32 9.08,20.32 9.08,59.69
GNDA
  Bottom 0.61: C4.1 DA2.6 | 73.85,34.29 66.23,34.29 64.96,33.02 R8.P$1 49.72,31.75 R7.2 45.91,31.75 44.64,30.48 44.64,29.21 | 44.64,29.21 R10.2 | 44.64,29.21 C6.P$2
  pour Bottom (isolate 0.61, no thermals): 99.25,50.8 81.47,50.8 73.85,43.18 73.85,33.02 84.01,33.02 90.36,26.67 103.06,26.67 103.06,33.02 100.52,35.56 100.52,49.53
HV_ON  (1 unrouted)
  Bottom 0.305: D3.3 P20.P$1
  Bottom 0.61: P19.P$1 R42.2
N$1  (1 unrouted)
  Bottom 0.406: DA1.4 D2.3 96.71,34.29 C1.PLUS 86.55,34.29 84.01,36.83 DA2.1
  Bottom 0.61: C4.2 DA2.8
N$2
  Bottom 0.406: D1.8 D1.7 R2.P$2 | D1.8 C3.1 | D2.1 96.96,37.08 97.98,38.1 D1.8
  Bottom 0.61: R3.2 R2.P$2
N$3
  Bottom 0.406: D1.6 R2.P$1 94.17,45.72 R4.2
N$4
  Bottom 0.406: D1.2 R1.2
N$5
  Bottom 0.406: DA2.3 DA2.2 DA2.3 | DA2.3 R3.1 85.28,41.91 VT1.3
N$6
  Bottom 0.406: VT1.1 84.33,46.67 R4.1
N$7
  Bottom 0.406: R5.P$2 DA2.5
N$8
  Bottom 0.406: R6.P$2 DA3.5
N$9
  Bottom 0.406: VT2.1 R11.P$1 R5.P$1
  Bottom 0.61: VT2.1 62.42,39.37 VD2.C
N$10
  Bottom 0.61: VT3.1 61.15,24.13 R6.P$1 R12.P$1
N$11
  Bottom 0.61: VT2.3 50.99,39.37 R7.1 VD2.A
N$12
  Bottom 0.61: R8.P$2 50.99,17.78 52.26,19.05 VT3.2
N$13  (1 unrouted)
  Bottom 0.406: D5.6 D5.7 R15.P$2
N$14
  Bottom 0.61: L2.L1 TR1.12 85.28,99.06 82.74,101.6 82.74,106.68 87.06,111 C24.+
N$15  (1 unrouted)
  Bottom 0.61: 37.02,33.02 VT5.1 30.67,32.64 | 30.67,32.64 R10.1 | 30.67,32.64 VT4.1 24.32,32.77
N$16
  Bottom 0.61: VT2.2 57.34,44.45 52.26,49.53 | 52.26,49.53 L1.L2 | 52.26,49.53 44.64,49.53 42.1,46.99 42.1,40.64 39.56,38.1 VT5.2 VT4.2 20.51,38.1 15.43,33.02 P21.P$1 15.43,26.67 16.7,25.4 C12.P$2
N$17
  Bottom 0.406: R12.P$2 DA3.7
N$18
  Bottom 0.406: R11.P$2 DA2.7
N$19
  Bottom 0.305: D3.9 182.56,66.04 183.07,66.55 184.09,66.55 X2.2 185.48,66.67 C7.2
N$20
  Bottom 0.305: D3.10 181.55,64.77 182.56,63.75 182.56,62.99 183.83,61.72 183.96,61.85 X2.1 185.48,61.85 C8.2
N$21
  Bottom 0.406: JP1.P$1 184.34,82.55 185.61,83.82 D4.1 185.61,87.63
N$22
  Bottom 0.406: JP1.P$3 X1.P$1
N$23
  Bottom 0.406: JP1.P$2 180.53,80.01 R13.P$2 179.26,76.2 D3.1
N$24
  Bottom 0.406: D5.5 186.88,40.64 | 186.88,40.64 R14.P$2 | 186.88,40.64 194.5,40.64 209.74,25.4 209.74,20.32 209.79,20.27 DA6.A
N$25
  Bottom 0.406: DA1.1 117.03,29.23 C2.PLUS R18.P$2
N$26
  Bottom 0.61: 24.32,43.18 20.51,43.18 16.7,46.99 R9.P$1 16.7,53.34 P1.P$1 | 24.32,43.18 VT4.3 | VT5.3 37.02,43.18 30.67,43.18 | 30.67,43.18 24.32,43.18 | 30.67,43.18 VD1.A
N$27
  Bottom 0.406: VT7.1 R19.P$1
N$28
  Bottom 0.406: VT6.1 R20.1
N$29
  Bottom 0.406: DA7.5 115.76,111.76 114.49,113.03 R19.P$2
N$30
  Bottom 0.406: R20.2 DA7.7
N$31
  Bottom 0.406: R39.1 DA3.3 DA3.2
N$32
  Bottom 0.61: TR1.11 101.79,95.25 104.33,97.79 VT6.2
N$33
  Bottom 0.61: TR1.13 92.9,102.87 103.06,113.03 103.06,114.81 103.82,115.57 VT7.2
N$34
  Bottom 0.406: DA7.3 DA8.9
N$35
  Bottom 0.406: DA7.2 DA8.10
N$36
  Bottom 0.406: R34.1 VD5.C R27.2
N$37
  Bottom 0.406: R33.P$1 122.11,96.52 R32.P$1
N$38
  Bottom 0.61: C23.P$1 24.32,96.52 | C23.P$1 R23.1 | C23.P$1 C22.P$2 R22.2 L3.L2
N$39
  Bottom 0.61: C22.P$1 R22.1 VD3.C 35.75,72.39 52.26,72.39 | 52.26,72.39 R24.P$1 | 52.26,72.39 L1.L1
N$40
  Bottom 0.406: DA8.2 R28.P$1 C25.1 R30.P$1
N$41
  Bottom 0.406: R24.P$2 119.57,72.39 124.65,77.47 R25.3
N$42
  Bottom 0.406: R25.1 R26.P$1
N$43
  Bottom 0.406: C30.2 DA7.1 DA8.11 | C30.2 DA7.8 C30.2 | DA8.8 134.81,107.95 133.54,106.68 133.54,104.14 132.27,102.87 DA8.11 | DA8.8 C31.PLUS | DA8.11 DA8.12 | C31.PLUS VT8.2 | DA8.8 C37.2 | R44.1 139.89,120.65 137.35,118.11 C31.PLUS
N$44
  Bottom 0.406: R27.1 87.82,85.09 61.15,111.76 33.21,111.76
  Bottom 0.61: VD4.A 33.21,111.76 R21.1 24.32,115.57 | R23.2 24.32,115.57 | 24.32,115.57 C23.P$2
N$45
  Bottom 0.406: R31.P$1 C26.2 DA8.3 R28.P$2 R29.P$2
N$46
  Bottom 0.406: C25.2 R29.P$1
N$47
  Bottom 0.406: DA8.6 R35.P$1
N$48
  Bottom 0.406: R34.2 R33.P$3 R33.P$2 DA8.15 R31.P$2 C26.1
N$49
  Bottom 0.61: L3.L1 TR1.21
N$50
  Bottom 0.406: DA8.5 C27.1
N$51
  Bottom 0.406: R36.P$2 DA8.4 C32.1
N$52  (via drill 0.8 pad 1.42)
  Top 0.406: v164.02,81.28 v171.64,81.28
  Bottom 0.305: IC1.2 156.4,88.9 157.67,90.17 IC1.6 162.75,90.17 164.02,88.9 v164.02,81.28
  Bottom 0.406: v171.64,81.28 R37.2
N$53
  Bottom 0.305: D3.2 181.8,74.93 R37.1
  Bottom 0.406: R37.1 C28.1
N$54
  Bottom 0.305: R38.2 IC1.3
N$55
  Bottom 0.61: TR1.22 VD4.C 43.37,102.87 VD3.A
N$56
  Bottom 0.406: R43.2 R30.P$2
N$57
  Bottom 0.406: R40.1 R9.P$2 | 70.04,54.61 C38.1 | 70.04,54.61 P14.P$1 | R49.P$1 R40.1 | R40.1 70.04,54.61
N$58
  Bottom 0.406: VT8.3 146.49,116.59 148.78,114.3 R41.P$1 R45.P$2
N$59
  Bottom 0.406: R41.P$2 VT9.C
N$60
  Bottom 0.406: JP2.P$1 P2.P$1
N$61
  Bottom 0.406: VT8.1 143.7,109.22 144.97,107.95 R45.P$1 P3.P$1
N$62
  Bottom 0.406: JP2.P$2 D8.1 C35.PLUS
N$63
  Bottom 0.406: VT9.B R42.1
N$64
  Bottom 0.406: R44.2 P5.P$1
N$65
  Bottom 0.406: HL2.A 218.26,89.27 217.36,90.17 P6.P$1
N$66
  Bottom 0.406: P9.P$1 219.9,106.68 HL1.A
N$67
  Bottom 0.305: R46.P$2 164.02,76.2 166.56,73.66 D3.26
N$68
  Bottom 0.406: P10.P$1 R46.P$1
N$69
  Bottom 0.305: D3.25 165.29,72.39 164.02,73.66 160.21,73.66 158.94,72.39 R47.P$2
N$70
  Bottom 0.406: P11.P$1 R47.P$1
N$71
  Bottom 0.305: P12.P$1 219.9,50.8 HL3.A
N$72
  Bottom 0.305: D3.12 181.8,62.23 185.61,58.42 R48.2
N$73
  Bottom 0.406: R48.1 203.39,58.42 P13.P$1
PGC
  Bottom 0.305: D3.27 167.83,74.93 166.56,76.2 166.56,86.36 167.83,87.63 X1.P$5
PGD
  Bottom 0.305: D3.28 168.85,84.84 170.37,86.36 X1.P$4
PWM  (via drill 0.8 pad 1.42)
  Top 0.305: v157.67,55.88 v184.34,55.88
  Bottom 0.305: D3.13 181.8,60.96 184.34,58.42 v184.34,55.88
  Bottom 0.406: v157.67,55.88 157.67,53.34 146.24,41.91 R1.1
RXD  (via drill 0.8 pad 1.42)
  Top 0.305: v164.02,50.8 v188.15,50.8
  Bottom 0.305: D3.18 166.56,63.5 164.02,60.96 v164.02,50.8
  Bottom 0.406: v188.15,50.8 190.69,50.8 198.31,43.18 R17.P$2 200.85,40.64 208.47,33.02 209.74,33.02 DA5.3
TRIG  (via drill 0.8 pad 1.42)
  Top 0.406: v162.75,71.12 v190.69,71.12
  Bottom 0.305: v162.75,71.12 162.75,69.85 165.29,67.31 D3.21
  Bottom 0.406: DA4.3 210,113.29 209.74,113.03 209.74,107.19 207.96,105.41 R16.P$2 205.93,86.36 193.23,71.12 v190.69,71.12
TXD
  Bottom 0.305: D5.1 169.1,48.26 166.56,50.8 166.56,60.96 167.83,62.23 D3.17 169.1,62.23
  Bottom 0.406: D5.1 D5.2
VFB
  Bottom 0.406: R25.2 DA8.1 R38.1
VREF  (via drill 0.8 pad 1.42)
  Top 0.406: v127.19,81.28 v141.16,81.28 | v127.19,87.63 v127.19,95.25
  Bottom 0.406: DA8.13 DA8.14 v127.19,95.25 | DA8.13 R32.P$2 | DA8.13 C32.2 | v141.16,81.28 R43.1 | v127.19,81.28 v127.19,87.63

### Text on the board
Document: start | HV ON